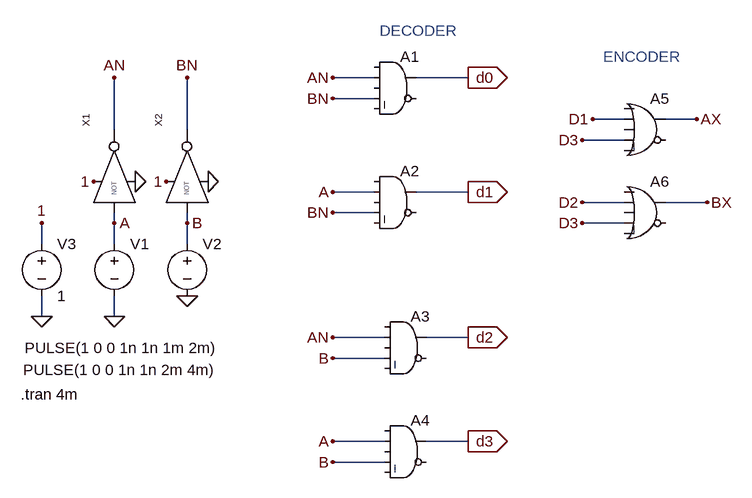
[diagram p0: schematic 2-4 decoder+encoder.asc]
2-4 decoder+encoder.asc, the LTspice schematic file:
Version 4
SHEET 1 880 680
WIRE -192 -16 -256 -16
WIRE -48 -16 -128 -16
WIRE -192 16 -256 16
WIRE 192 48 144 48
WIRE 304 48 256 48
WIRE -592 64 -592 -16
WIRE -480 64 -480 -16
WIRE 192 80 128 80
WIRE -192 160 -256 160
WIRE -48 160 -128 160
WIRE 192 176 128 176
WIRE 320 176 256 176
WIRE -192 192 -256 192
WIRE -592 208 -592 192
WIRE -480 208 -480 192
WIRE 192 208 128 208
WIRE -704 240 -704 208
WIRE -592 240 -592 208
WIRE -480 240 -480 208
WIRE -704 352 -704 320
WIRE -592 352 -592 320
WIRE -176 384 -256 384
WIRE -48 384 -112 384
WIRE -176 416 -256 416
WIRE -176 544 -256 544
WIRE -48 544 -112 544
WIRE -176 576 -256 576
FLAG -592 352 0
FLAG -480 320 0
FLAG -704 352 0
FLAG -48 -16 d0
IOPIN -48 -16 Out
FLAG -48 160 d1
IOPIN -48 160 Out
FLAG -48 384 d2
IOPIN -48 384 Out
FLAG -48 544 d3
IOPIN -48 544 Out
FLAG -448 144 0
FLAG -560 144 0
FLAG -512 144 1
FLAG -624 144 1
FLAG -704 208 1
FLAG -256 -16 AN
FLAG -256 16 BN
FLAG -256 160 A
FLAG -256 192 BN
FLAG -256 384 AN
FLAG -256 416 B
FLAG -256 544 A
FLAG -256 576 B
FLAG -592 208 A
FLAG -480 208 B
FLAG -480 -16 BN
FLAG -592 -16 AN
FLAG 128 80 D3
FLAG 144 48 D1
FLAG 128 176 D2
FLAG 128 208 D3
FLAG 304 48 AX
FLAG 320 176 BX
SYMBOL Digital\\and -160 -64 R0
SYMATTR InstName A1
SYMBOL Digital\\and -160 112 R0
SYMATTR InstName A2
SYMBOL Digital\\and -144 336 R0
SYMATTR InstName A3
SYMBOL Digital\\and -144 496 R0
SYMATTR InstName A4
SYMBOL voltage -592 224 R0
WINDOW 123 0 0 Left 0
WINDOW 39 0 0 Left 0
WINDOW 3 -138 176 Left 2
SYMATTR InstName V1
SYMATTR Value PULSE(1 0 0 1n 1n 1m 2m)
SYMBOL voltage -480 224 R0
WINDOW 123 0 0 Left 0
WINDOW 39 0 0 Left 0
WINDOW 3 -252 210 Left 2
SYMATTR InstName V2
SYMATTR Value PULSE(1 0 0 1n 1n 2m 4m)
SYMBOL voltage -704 224 R0
WINDOW 123 0 0 Left 0
WINDOW 39 0 0 Left 0
SYMATTR InstName V3
SYMATTR Value 1
SYMBOL NOT4 -576 128 R270
SYMATTR InstName X1
SYMBOL NOT4 -464 128 R270
SYMATTR InstName X2
SYMBOL Digital\\or 224 0 R0
SYMATTR InstName A5
SYMBOL Digital\\or 224 128 R0
SYMATTR InstName A6
TEXT -736 472 Left 2 !.tran 4m
TEXT -184 -88 Left 2 ;DECODER
TEXT 160 -48 Left 2 ;ENCODER

The netlist it stands for:
* 2-4 decoder+encoder.asc
A1 0 AN 0 BN 0 0 d0 0 AND
A2 0 A 0 BN 0 0 d1 0 AND
A3 0 AN 0 B 0 0 d2 0 AND
A4 0 A 0 B 0 0 d3 0 AND
V1 A 0 PULSE(1 0 0 1n 1n 1m 2m)
V2 B 0 PULSE(1 0 0 1n 1n 2m 4m)
V3 1 0 1
XX1 A 1 0 AN NOT4  ; pins A VH VL OUT
XX2 B 1 0 BN NOT4  ; pins A VH VL OUT
A5 0 d1 0 d3 0 0 AX 0 OR
A6 0 d2 0 d3 0 0 BX 0 OR
.tran 4m
* DECODER
* ENCODER
.backanno
.end